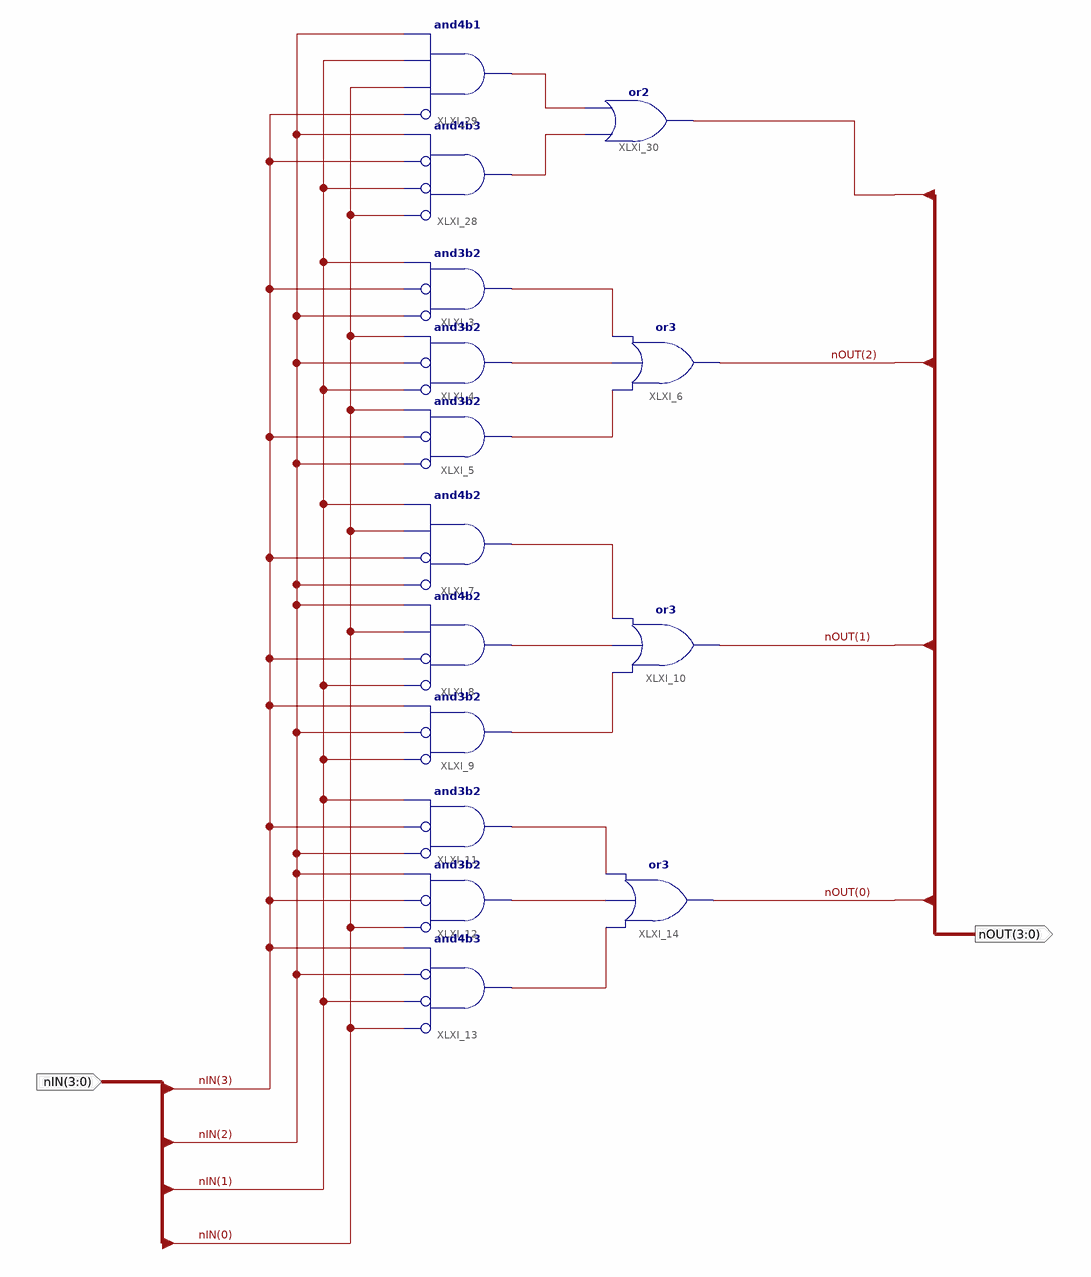
[diagram p0: schematic sheet 1]
// Xilinx ISE schematic shuffle.sch (spartan6) as structural Verilog: 15 symbols, 2 ports
module shuffle (
  input  [3:0] nIN,
  output [3:0] nOUT
);

  wire XLXN_15, XLXN_16, XLXN_17, XLXN_18, XLXN_19, XLXN_20, XLXN_21, XLXN_22, XLXN_23, XLXN_46, XLXN_47;

  and XLXI_3 (XLXN_15, ~nIN[2], ~nIN[3], nIN[1]);  // and3b2
  and XLXI_4 (XLXN_16, ~nIN[1], ~nIN[2], nIN[0]);  // and3b2
  and XLXI_5 (XLXN_17, ~nIN[2], ~nIN[3], nIN[0]);  // and3b2
  or XLXI_6 (nOUT[2], XLXN_17, XLXN_16, XLXN_15);
  and XLXI_7 (XLXN_18, ~nIN[2], ~nIN[3], nIN[0], nIN[1]);  // and4b2
  and XLXI_8 (XLXN_19, ~nIN[1], ~nIN[3], nIN[0], nIN[2]);  // and4b2
  and XLXI_9 (XLXN_20, ~nIN[1], ~nIN[2], nIN[3]);  // and3b2
  or XLXI_10 (nOUT[1], XLXN_20, XLXN_19, XLXN_18);
  and XLXI_11 (XLXN_21, ~nIN[2], ~nIN[3], nIN[1]);  // and3b2
  and XLXI_12 (XLXN_22, ~nIN[0], ~nIN[3], nIN[2]);  // and3b2
  and XLXI_13 (XLXN_23, ~nIN[0], ~nIN[1], ~nIN[2], nIN[3]);  // and4b3
  or XLXI_14 (nOUT[0], XLXN_23, XLXN_22, XLXN_21);
  and XLXI_28 (XLXN_47, ~nIN[0], ~nIN[1], ~nIN[3], nIN[2]);  // and4b3
  and XLXI_29 (XLXN_46, ~nIN[3], nIN[0], nIN[1], nIN[2]);  // and4b1
  or XLXI_30 (nOUT[3], XLXN_47, XLXN_46);
endmodule
